# EAGLE schematic arduino_card (EAGLE 6.1)
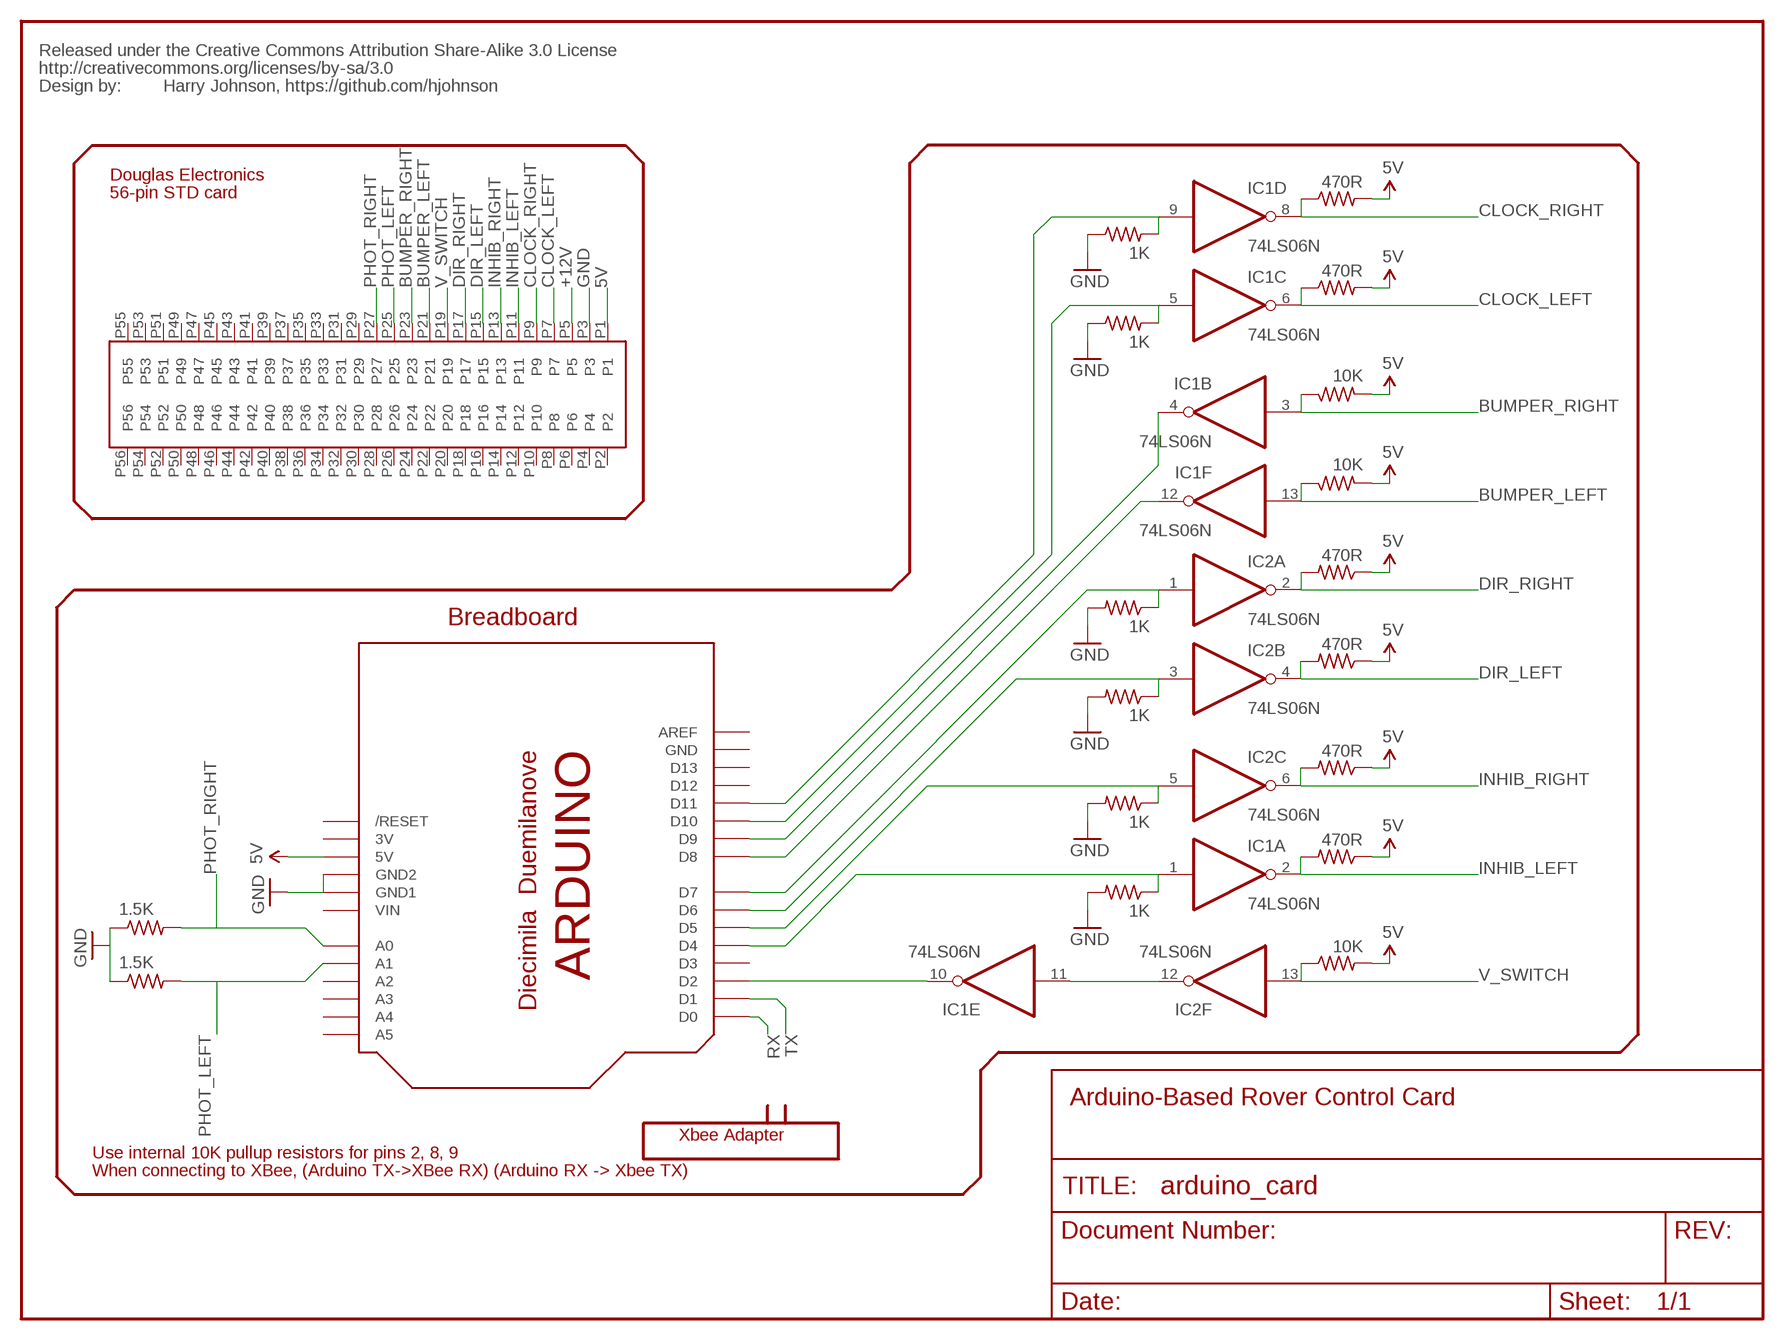
[diagram p0: schematic, sheet 1]

## Parts
IC1  74LS06N  [DIL14]
IC2  74LS06N  [DIL14]
R1  1.5K  R-US_0207/10  [0207/10]
R2  1.5K  R-US_0207/10  [0207/10]
R3  10K  R-US_0207/10  [0207/10]
R4  10K  R-US_0207/10  [0207/10]
R5  10K  R-US_0207/10  [0207/10]
R7  1K  R-US_0207/10  [0207/10]
R8  470R  R-US_0207/10  [0207/10]
R9  1K  R-US_0207/10  [0207/10]
R10  470R  R-US_0207/10  [0207/10]
R11  1K  R-US_0207/10  [0207/10]
R12  470R  R-US_0207/10  [0207/10]
R13  470R  R-US_0207/10  [0207/10]
R14  1K  R-US_0207/10  [0207/10]
R15  1K  R-US_0207/10  [0207/10]
R16  1K  R-US_0207/10  [0207/10]
R17  470R  R-US_0207/10  [0207/10]
R18  470R  R-US_0207/10  [0207/10]
U$1  ARDUINODUEMILANOVE  [ARDUINO]
U$8  CREATIVE_COMMONS  [CREATIVE_COMMONS]
U$12  STD_BUS  [STDBUS]

## Nets
5V: R3.2 R4.2 R5.2 R8.1 R10.1 R12.1 R13.1 R17.2 R18.2 U$1.5V U$12.P1
+12V: U$12.P5
BUMPER_LEFT: IC1.13(F:I) R5.1 U$12.P21
BUMPER_RIGHT: IC1.3(B:I) R3.1 U$12.P23
CLOCK_LEFT: IC1.6(C:O) R18.1 U$12.P7
CLOCK_RIGHT: IC1.8(D:O) R17.1 U$12.P9
DIR_LEFT: IC2.4(B:O) R10.2 U$12.P15
DIR_RIGHT: IC2.2(A:O) R8.2 U$12.P17
GND: R1.1 R2.1 R7.2 R9.2 R11.2 R14.2 R15.1 R16.1 U$1.GND1 U$1.GND2 U$12.P3
INHIB_LEFT: IC1.2(A:O) R13.2 U$12.P11
INHIB_RIGHT: IC2.6(C:O) R12.2 U$12.P13
N$3: IC1.10(E:O) U$1.D2
N$5: IC1.1(A:I) R14.1 U$1.D4
N$6: IC2.5(C:I) R11.1 U$1.D5
N$7: IC2.3(B:I) R9.1 U$1.D6
N$8: IC2.1(A:I) R7.1 U$1.D7
N$9: IC1.12(F:O) U$1.D8
N$10: IC1.4(B:O) U$1.D9
N$11: IC1.5(C:I) R16.2 U$1.D10
N$12: IC1.9(D:I) R15.2 U$1.D11
N$15: IC1.11(E:I) IC2.12(F:O)
PHOT_LEFT: R1.2 U$1.A1 U$12.P25
PHOT_RIGHT: R2.2 U$1.A0 U$12.P27
RX: U$1.D0
TX: U$1.D1
V_SWITCH: IC2.13(F:I) R4.1 U$12.P19
Unconnected: IC2.8(D:O) IC2.9(D:I) IC2.10(E:O) IC2.11(E:I) U$1.A2 U$1.A3 U$1.A4 U$1.A5 U$1.AREF U$1.D3 U$1.D12 U$1.D13 U$1.RESET(/RESET) U$12.P2 U$12.P4 U$12.P6 U$12.P8 U$12.P10 U$12.P12 U$12.P14 U$12.P16 U$12.P18 U$12.P20 U$12.P22 U$12.P24 U$12.P26 U$12.P28 U$12.P29 U$12.P30 U$12.P31 U$12.P32 U$12.P33 U$12.P34 U$12.P35 U$12.P36 U$12.P37 U$12.P38 U$12.P39 U$12.P40 U$12.P41 U$12.P42 U$12.P43 U$12.P44 U$12.P45 U$12.P46 U$12.P47 U$12.P48 U$12.P49 U$12.P50 U$12.P51 U$12.P52 U$12.P53 U$12.P54 U$12.P55 U$12.P56

## Notes on the sheet
- Harry Johnson, https://github.com/hjohnson
- Douglas Electronics
- 56-pin STD card
- Breadboard
- Arduino-Based Rover Control Card
- Xbee Adapter
- Use internal 10K pullup resistors for pins 2, 8, 9
- When connecting to XBee, (Arduino TX->XBee RX) (Arduino RX -> Xbee TX)

## Power pins joined to a net without a drawn wire
3V: U$1.3V
GND: IC1.7(P:GND) IC2.7(P:GND) U$1.GND
VCC: IC1.14(P:VCC) IC2.14(P:VCC)
VIN: U$1.VIN

## Library data of the parts
IC1 IC2 = 74xx-us:74*06: Hex INVERTER, open collector high-voltage output
R1-R5 R7-R18 = adafruit:R-US_: RESISTOR, American symbol
U$1 = adafruit:ARDUINO: Arduino Diecimila/Duemilanove Make a shield with ease, this package has all the named pins as well as the two mounting drill holes and an outline of the USB and DC power connector. The outline is on the DIMENSION layer, so if your board house uses it they will cut the outline to match. http://www.ladyada.net/library/pcb/eaglelibrary.html
U$8 = SparkFun:CREATIVE_COMMONS
U$12 = myLib:STD_BUS